# EasyEDA Pro project ProProject_nRF52840无线键盘_2024-02-15.epro, schematic Schematic2
Create Date: 2023-09-05; Page Name: P1; Project Name: 键盘成品; Schematic Name: Schematic2; Update Date: 2023-09-05; Company: 嘉立创EDA; Page Size: A4; Version: V1.0
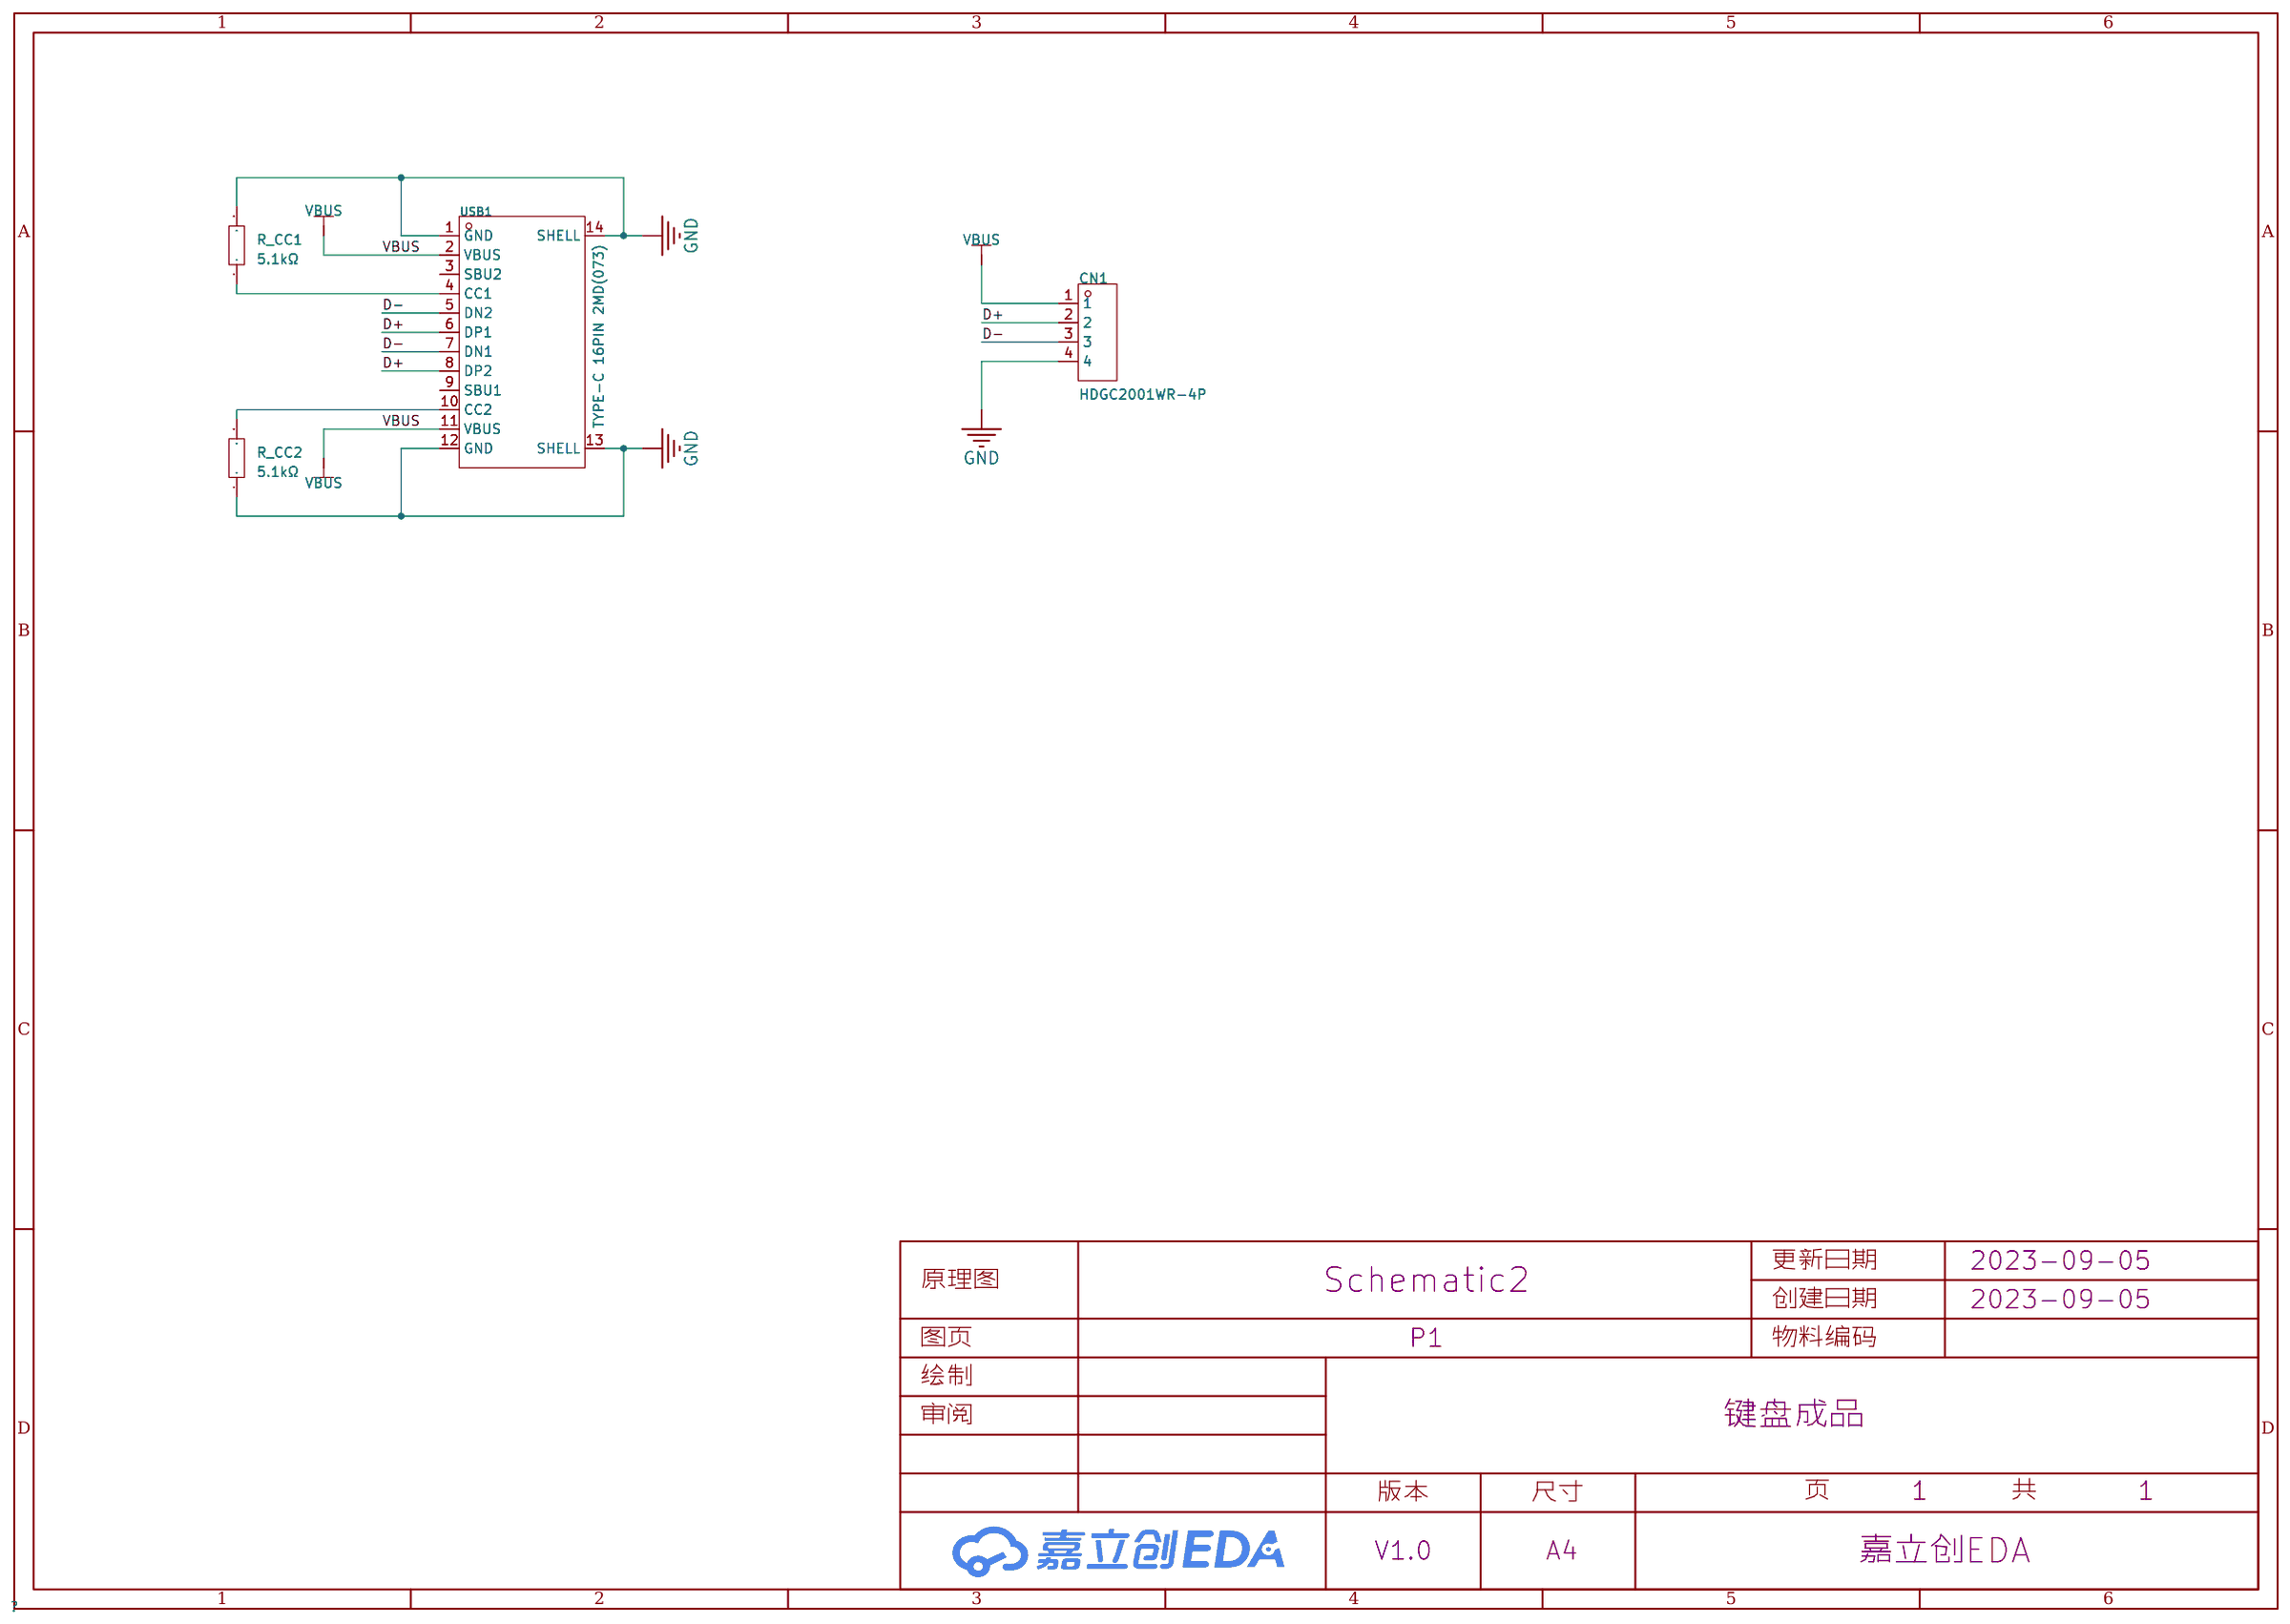
[diagram p11: schematic sheet]

## Parts
CN1  HDGC2001WR-4P  [CONN-TH_4P-P2.00_HDGC_HDGC2001WR-4P]
R_CC1  5.1kΩ  [R0805]
R_CC2  5.1kΩ  [R0805]
USB1  TYPE-C 16PIN 2MD(073)  [USB-C-SMD_TYPE-C-6PIN-2MD-073]

## Library data of the parts
CN1 = HDGC2001WR-4P: LCSC Part Name: PH2.0弯针 4P; Supplier Part: C5175241; Manufacturer: HDGC(华德共创); Supplier Footprint: 弯插,P=2mm; JLCPCB Part Class: 扩展库; Datasheet: https://atta.szlcsc.com/upload/public/pdf/source/20220916/36534CA64A2134C65DEF28B604EC5CCB.pdf; Supplier: LCSC
R_CC1 R_CC2 = 0805W8F5101T5E: 电阻类型:厚膜电阻;阻值:5.1kΩ;精度:±1%;功率:125mW;; LCSC Part Name: 5.1kΩ ±1% 125mW; Supplier Part: C27834; Manufacturer: UNI-ROYAL(厚声); Supplier Footprint: 0805; JLCPCB Part Class: Basic Part; Datasheet: https://atta.szlcsc.com/upload/public/pdf/source/20200306/C422600_1E6D84923E4A46A82E41ADD87F860B5C.pdf; Supplier: LCSC; Type: 厚膜电阻; Tolerance: ±1%; Power(Watts): 125mW; Temperature Coefficient: ±100ppm/℃; Overload Voltage (Max): 150V; Operating Temperature Range: -55℃~+155℃
USB1 = TYPE-C 16PIN 2MD(073): 连接器类型:Type-C;标准:-;公母:母座;触点数量:16;端口数量:1;安装方式:卧贴;额定电流 - 电源:5A;工作温度范围:-25℃~+85℃;; LCSC Part Name: TYPE-C母座 16P 4脚插件带定位柱 不锈钢外壳 2次模顶; Supplier Part: C2765186; Manufacturer: SHOU HAN(首韩); Supplier Footprint: SMD; JLCPCB Part Class: 扩展库; Supplier: LCSC; Connector Type: Type-C; Gender: 母座; Number of Contacts: 16; Number of Ports: 1; Mounting Style: 卧贴; Current Rating - Power (Max): 5A; Operating Temperature Range: -25℃~+85℃

## Nets
GND: CN1.4 R_CC1.2 R_CC2.1 USB1.1(GND) USB1.12(GND) USB1.13(SHELL) USB1.14(SHELL)
VBUS: CN1.1 USB1.2(VBUS) USB1.11(VBUS)
D+: CN1.2 USB1.6(DP1) USB1.8(DP2)
D-: CN1.3 USB1.5(DN2) USB1.7(DN1)
$1N227: R_CC1.1 USB1.4(CC1)
$1N228: R_CC2.2 USB1.10(CC2)

Not connected (* = marked no-connect by the designer): USB1 3(SBU2) 9(SBU1)
